# Altium schematic sheet Arduino_to_G2LaunchPad.SchDoc
size A
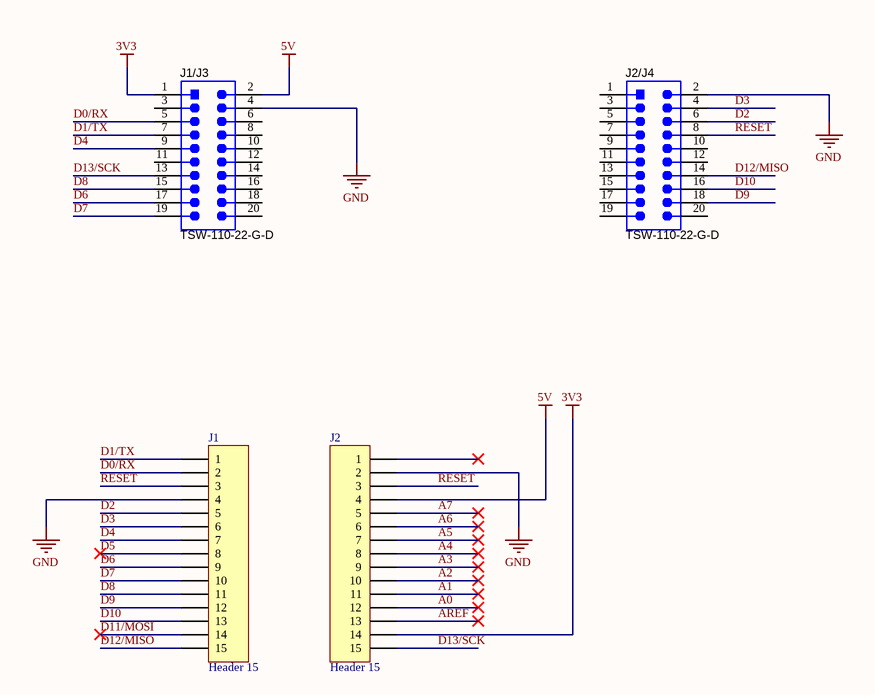
[diagram p0: Arduino_to_G2LaunchPad.SchDoc]

## Parts
J1  Header 15  [HDR1X15]
J1/J3  TSW-110-22-G-D  [Samtec_TSW-110-22-x-D]
J2  Header 15  [HDR1X15]
J2/J4  TSW-110-22-G-D  [Samtec_TSW-110-22-x-D]

## Nets
3V3: J1/J3.1 J2.14
5V: J1/J3.2 J2.4
GND: J1.4 J1/J3.4 J2.2 J2/J4.2
A0: J2.12
A1: J2.11
A2: J2.10
A3: J2.9
A4: J2.8
A5: J2.7
A6: J2.6
A7: J2.5
AREF: J2.13
D0/RX: J1.2 J1/J3.5
D1/TX: J1.1 J1/J3.7
D2: J1.5 J2/J4.6
D3: J1.6 J2/J4.4
D4: J1.7 J1/J3.9
D5: J1.8
D6: J1.9 J1/J3.17
D7: J1.10 J1/J3.19
D8: J1.11 J1/J3.15
D9: J1.12 J2/J4.18
D10: J1.13 J2/J4.16
D11/MOSI: J1.14
D12/MISO: J1.15 J2/J4.14
D13/SCK: J1/J3.13 J2.15
RESET: J1.3 J2.3 J2/J4.8

Not connected (* = marked no-connect by the designer): J1/J3 3 6 8 10 11 12 14 16 18 20; J2 1*; J2/J4 1 3 5 7 9 10 11 12 13 15 17 19 20

## Library data of the parts
J1 J2 = Header 15: Header, 15-Pin; LatestRevisionDate: 17-Jul-2002; LatestRevisionNote: Re-released for DXP Platform.; Publisher: Altium Limited
J1/J3 J2/J4 = TSW-110-22-G-D: Header, 2.54mm, 10x2, Gold, TH; Manufacturer: Samtec; SymbolCreator: a0412235; Pitch_mm: 2.54; Gender: Male; Shrouded: N; Row_Count: 2; Current_A: 5.7; Voltage_V: 550; Cert_CSA: Y; SymbolVersion: 2013-09-12; PartNumber: TSW-110-22-G-D; PackageReference: Header, 2.54mm, 10x2, TH; ClassName: Header; CompType: Header; RoHS: Y; MountType: TH; ComponentLink1Description: Datasheet URL; ComponentLink1URL: http://suddendocs.samtec.com/prints/tsw-xxx-xx-xxx-x-xx-xxx-mkt.pdf; Orientation: Vertical; PinCount: 20; RowSpacing_mm: 2.54; ContactFinish: Gold; Color: Black; Cert_UL: Y; Publisher: Texas Instruments; LatestRevisionDate: 2017-06-20; Supplier 1: Digi-Key; Supplier Part Number 1: TSW-110-22-G-D-ND; Supplier 2: Newark; Supplier Part Number 2: 80P1681; Supplier 3: Farnell; Supplier Part Number 3: 2029151